# EAGLE design Day0_Aditya Rizky Maulana_13215007 (EAGLE 7.6.0)
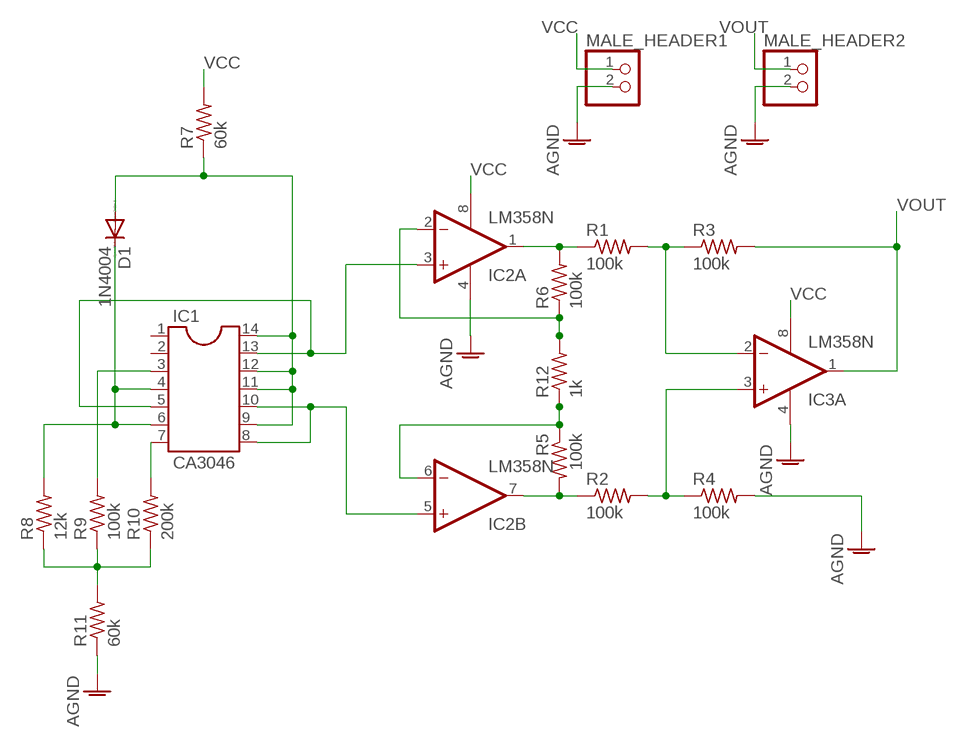
[diagram p0: schematic, sheet 1]

## Parts
D1  1N4004  [DO41-10]
IC1  CA3046  DIL14  [DIL14]
IC2  LM358N  [DIL08]
IC3  LM358N  [DIL08]
MALE_HEADER1  PINHD-1X2  [1X02]
MALE_HEADER2  PINHD-1X2  [1X02]
R1  100k  R-US_0207/7  [0207/7]
R2  100k  R-US_0207/7  [0207/7]
R3  100k  R-US_0207/7  [0207/7]
R4  100k  R-US_0207/7  [0207/7]
R5  100k  R-US_0207/7  [0207/7]
R6  100k  R-US_0207/7  [0207/7]
R7  60k  R-US_0207/7  [0207/7]
R8  12k  R-US_0207/7  [0207/7]
R9  100k  R-US_0207/7  [0207/7]
R10  200k  R-US_0207/7  [0207/7]
R11  60k  R-US_0207/7  [0207/7]
R12  1k  R-US_0207/7  [0207/7]

## Nets
AGND [AGND]: IC2.4(P:V-) IC3.4(P:V-) MALE_HEADER1.2 MALE_HEADER2.2 R4.2 R11.1
N$1 [OTHER]: IC2.2(A:-IN) R6.1 R12.2
N$3 [OTHER]: IC1.8 IC1.10 IC2.5(B:+IN)
N$4 [OTHER]: IC2.7(B:OUT) R2.1 R5.2
N$5 [OTHER]: IC2.1(A:OUT) R1.1 R6.2
N$6 [OTHER]: IC1.5 IC1.13 IC2.3(A:+IN)
N$7 [OTHER]: IC2.6(B:-IN) R5.1 R12.1
N$8 [OTHER]: IC3.2(A:-IN) R1.2 R3.1
N$9 [OTHER]: IC3.3(A:+IN) R2.2 R4.1
N$11 [OTHER]: IC1.7 R10.2
N$12 [OTHER]: D1.C IC1.4 IC1.6 R8.2
N$14 [OTHER]: IC1.3 R9.2
N$15 [OTHER]: D1.A IC1.9 IC1.11 IC1.12 IC1.14 R7.1
N$17 [OTHER]: R8.1 R9.1 R10.1 R11.2
VCC: IC2.8(P:V+) IC3.8(P:V+) MALE_HEADER1.1 R7.2
VOUT: IC3.1(A:OUT) MALE_HEADER2.1 R3.2
Unconnected: IC1.1 IC1.2 IC3.5(B:+IN) IC3.6(B:-IN) IC3.7(B:OUT)

## Library data of the parts
D1 = diode:1N4004: DIODE general purpose rectifier, 1 A
IC1 = ic-package:DIL14: Dual In Line / Socket
IC2 IC3 = linear:LM358: OP AMP also LM158; LM258; LM2904 Source: http://cache.national.com/ds/LM/LM158.pdf
MALE_HEADER1 MALE_HEADER2 = pinhead:PINHD-1X2: PIN HEADER
R1-R12 = resistor:R-US_: RESISTOR, American symbol

## Net classes
0 VCC: width 0.381 mm, clearance 0.205 mm
1 AGND: width 0.381 mm, clearance 0.205 mm to class 0, clearance 0.205 mm
2 OTHER: width 0.254 mm, clearance 0.205 mm to class 0, clearance 0.205 mm to class 1, clearance 0.205 mm

## Board
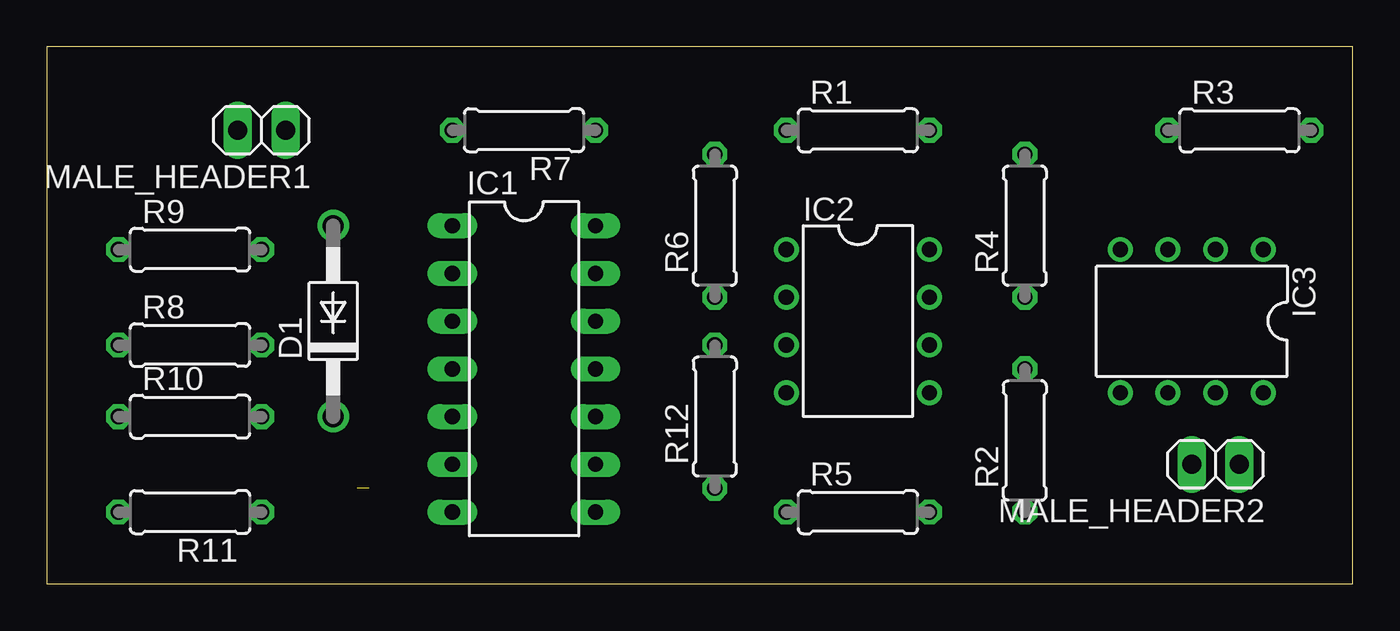
[diagram p1: board, top side]
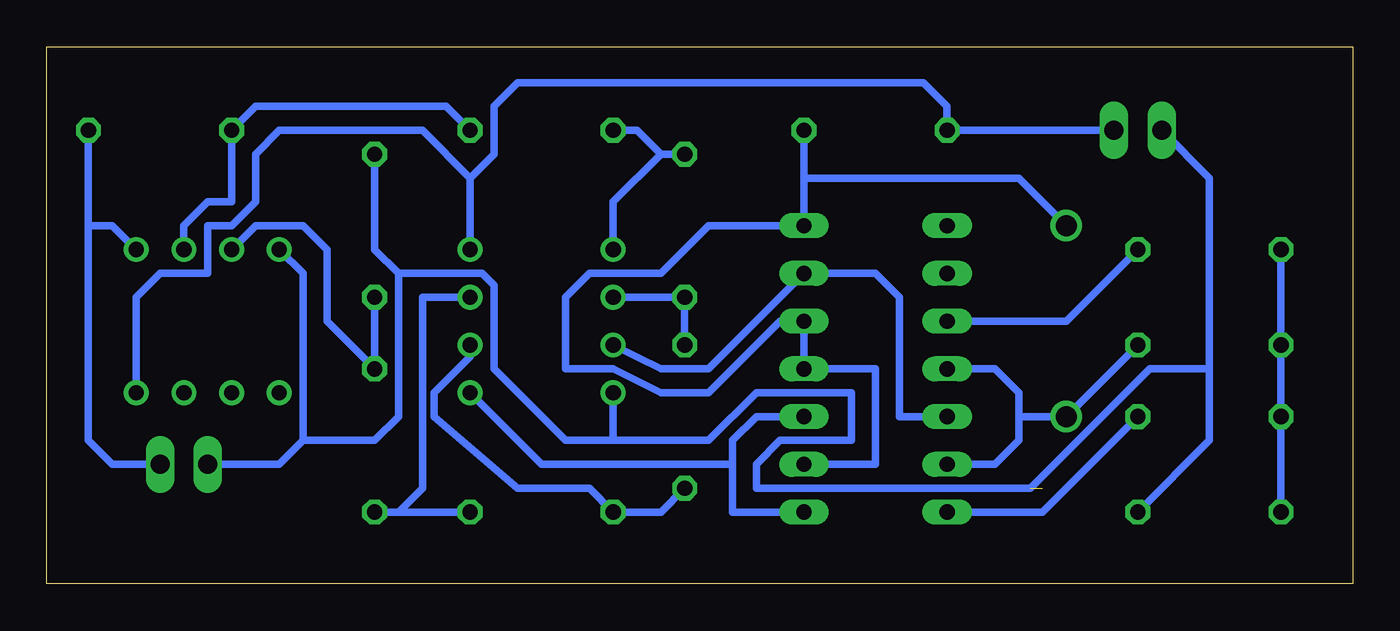
[diagram p2: board, bottom side, seen from below]

Size 69.52 x 28.57 mm. Coordinates in mm from the lower left corner, seen from the top.
Outline: 0,0 69.52,0 69.52,28.57 0,28.57 0,0
Copper layers (1*16): Top 0.035mm / dielectric 1.5mm / Bottom 0.035mm
Design rules "default": minimum track width 10mil, minimum drill 24mil, track to track 8mil, track to pad 8mil, pad to pad 8mil, via to via 8mil, smd to smd 8mil, copper to edge 40mil, drill to drill 8mil, minimum pad ring 10mil, minimum via ring 8mil, stop-mask expansion 4mil, vias tented up to drill 0mil, thermal gap 10mil

### Footprints (pad centres in the part's own frame; a part is rotated, then mirrored left to right if it is on the bottom)
DO41-10 = drill 1.118: A 5.08,0; C -5.08,0
DIL14 = drill 0.813 long: 1 -7.62,-3.81; 2 -5.08,-3.81; 3 -2.54,-3.81; 4 0,-3.81; 5 2.54,-3.81; 6 5.08,-3.81; 7 7.62,-3.81; 8 7.62,3.81; 9 5.08,3.81; 10 2.54,3.81; 11 0,3.81; 12 -2.54,3.81; 13 -5.08,3.81; 14 -7.62,3.81
DIL08 = drill 0.813 pad 1.27: 1 -3.81,-3.81; 2 -1.27,-3.81; 3 1.27,-3.81; 4 3.81,-3.81; 5 3.81,3.81; 6 1.27,3.81; 7 -1.27,3.81; 8 -3.81,3.81
1X02 = drill 1.016 long: 1 -1.27,0; 2 1.27,0
0207/7 = drill 0.813 octagon: 1 -3.81,0; 2 3.81,0

### Placement (x,y rotation side)
D1  15.24,13.97 90 top
IC1  25.4,11.43 270 top
IC2  43.18,13.97 270 top
IC3  60.96,13.97 180 top
MALE_HEADER1  11.43,24.13 180 top
MALE_HEADER2  62.23,6.35 180 top
R1  43.18,24.13 0 top
R2  52.07,7.62 90 top
R3  63.5,24.13 0 top
R4  52.07,19.05 90 top
R5  43.18,3.81 0 top
R6  35.56,19.05 90 top
R7  25.4,24.13 180 top
R8  7.62,12.7 0 top
R9  7.62,17.78 0 top
R10  7.62,8.89 0 top
R11  7.62,3.81 180 top
R12  35.56,8.89 90 top

### Tracks (layer width: path | path; a pad name or v marks a point on that pad's centre or on a via)
AGND  (1 unrouted)
  Bottom 0.406: MALE_HEADER1.2 7.62,21.59 7.62,11.43 | 7.62,11.43 7.62,7.62 R11.1 | MALE_HEADER2.2 57.15,6.35 55.88,7.62 | 55.88,7.62 55.88,16.51 IC3.4 | R4.2 52.07,17.78 50.8,16.51 | 50.8,16.51 50.8,8.89 52.07,7.62 55.88,7.62 | IC2.4 39.37,7.62 | 39.37,7.62 41.91,7.62 45.72,11.43 45.72,15.88 46.36,16.51 50.8,16.51 | 39.37,7.62 34.29,7.62 31.75,10.16 26.67,10.16 26.67,7.62 30.48,7.62 31.75,6.35 31.75,5.08 17.14,5.08 10.8,11.43 7.62,11.43
N$1
  Bottom 0.406: IC2.2 R6.1 R12.2
N$3
  Bottom 0.406: IC1.8 33.02,3.81 33.02,6.35 | 33.02,6.35 43.18,6.35 IC2.5 | 33.02,6.35 33.02,7.62 31.75,8.89 IC1.10
N$4
  Bottom 0.406: R5.2 R2.1 50.8,3.81 49.53,5.08 49.53,15.24 IC2.7
N$5
  Bottom 0.406: R6.2 36.83,22.86 | 36.83,22.86 39.37,20.32 IC2.1 | R1.1 38.1,24.13 36.83,22.86
N$6
  Bottom 0.406: IC2.3 36.83,11.43 34.29,11.43 IC1.13 25.4,16.51 24.13,15.24 24.13,8.89 IC1.5
N$7
  Bottom 0.406: IC2.6 46.99,12.07 48.9,10.16 48.9,8.89 44.45,5.08 40.64,5.08 R5.1 36.83,3.81 R12.1
N$8
  Bottom 0.406: R1.2 48.26,25.4 58.42,25.4 R3.1 59.69,20.32 60.96,20.32 62.23,19.05 IC3.2
N$9
  Bottom 0.406: IC3.3 58.42,19.05 55.88,19.05 54.61,17.78 54.61,13.97 R2.2 R4.1
N$11
  Bottom 0.406: R10.2 16.51,3.81 IC1.7
N$12
  Bottom 0.406: IC1.6 19.05,6.35 17.78,7.62 17.78,8.89 | 17.78,8.89 D1.C R8.2 | 17.78,8.89 17.78,10.16 19.05,11.43 IC1.4
N$14
  Bottom 0.406: R9.2 15.24,13.97 IC1.3
N$15
  Bottom 0.406: IC1.9 25.4,6.35 25.4,11.43 IC1.11 IC1.12 30.48,13.97 34.29,10.16 36.83,10.16 39.37,11.43 41.91,11.43 41.91,15.24 40.64,16.51 36.83,16.51 34.29,19.05 IC1.14 29.21,21.59 | R7.1 29.21,21.59 | D1.A 17.78,21.59 29.21,21.59
N$17
  Bottom 0.406: R9.1 R8.1 R10.1 R11.2
VCC
  Bottom 0.406: MALE_HEADER1.1 R7.2 21.59,25.4 22.86,26.67 44.45,26.67 45.72,25.4 45.72,22.86 46.99,21.59 | IC3.8 64.77,15.24 63.5,16.51 60.96,16.51 60.96,19.05 59.69,19.05 58.42,20.32 58.42,22.86 57.15,24.13 49.53,24.13 46.99,21.59 | IC2.8 46.99,21.59
VOUT
  Bottom 0.406: R3.2 67.31,19.05 | 67.31,19.05 66.04,19.05 IC3.1 | MALE_HEADER2.1 66.04,6.35 67.31,7.62 67.31,19.05